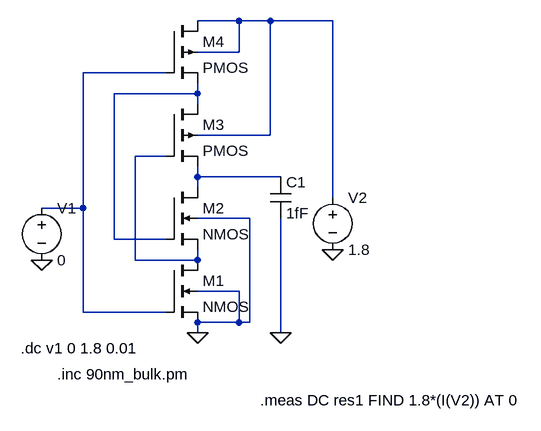
[diagram p0: schematic staticpowerLECTOR@0.asc]
staticpowerLECTOR@0.asc, the LTspice schematic file:
Version 4
SHEET 1 880 680
WIRE 288 -128 224 -128
WIRE 336 -128 288 -128
WIRE 432 -128 336 -128
WIRE 288 -80 288 -128
WIRE 288 -80 224 -80
WIRE 176 -48 48 -48
WIRE 224 -16 224 -32
WIRE 224 -16 96 -16
WIRE 224 0 224 -16
WIRE 336 48 336 -128
WIRE 336 48 224 48
WIRE 176 80 128 80
WIRE 224 112 224 96
WIRE 352 112 224 112
WIRE 224 128 224 112
WIRE 432 144 432 -128
WIRE 48 160 48 -48
WIRE 48 160 -16 160
WIRE 304 176 224 176
WIRE 96 208 96 -16
WIRE 176 208 96 208
WIRE 128 240 128 80
WIRE 224 240 224 224
WIRE 224 240 128 240
WIRE 288 288 224 288
WIRE 48 320 48 160
WIRE 176 320 48 320
WIRE 288 336 288 288
WIRE 288 336 224 336
WIRE 304 336 304 176
WIRE 304 336 288 336
WIRE 224 352 224 336
WIRE 352 352 352 176
FLAG -16 240 0
FLAG 224 352 0
FLAG 432 224 0
FLAG 352 352 0
SYMBOL voltage -16 144 R0
SYMATTR InstName V1
SYMATTR Value 0
SYMBOL voltage 432 128 R0
SYMATTR InstName V2
SYMATTR Value 1.8
SYMBOL nmos4 176 240 R0
SYMATTR InstName M1
SYMATTR Value2 l=100n w=4000n
SYMBOL nmos4 176 128 R0
SYMATTR InstName M2
SYMATTR Value2 l=100n w=4000n
SYMBOL pmos4 176 0 R0
SYMATTR InstName M3
SYMATTR Value2 l=100n w=12000n
SYMBOL pmos4 176 -128 R0
SYMATTR InstName M4
SYMATTR Value2 l=100n w=12000n
SYMBOL cap 336 112 R0
SYMATTR InstName C1
SYMATTR Value 1fF
TEXT -48 376 Left 2 !.dc v1 0 1.8 0.01
TEXT 8 416 Left 2 !.inc 90nm_bulk.pm
TEXT 320 456 Left 2 !.meas DC res1 FIND 1.8*(I(V2)) AT 0

The netlist it stands for:
* staticpowerLECTOR@0.asc
V1 N002 0 0
V2 N001 0 1.8
M1 N004 N002 0 0 NMOS l=100n w=4000n
M2 N005 N003 N004 0 NMOS l=100n w=4000n
M3 N003 N004 N005 N001 PMOS l=100n w=12000n
M4 N001 N002 N003 N001 PMOS l=100n w=12000n
C1 N005 0 1fF
.model NMOS NMOS
.model PMOS PMOS
.lib standard.mos
.dc v1 0 1.8 0.01
.inc 90nm_bulk.pm
.meas DC res1 FIND 1.8*(I(V2)) AT 0
.backanno
.end